# EAGLE design heart (EAGLE 9.4.2)
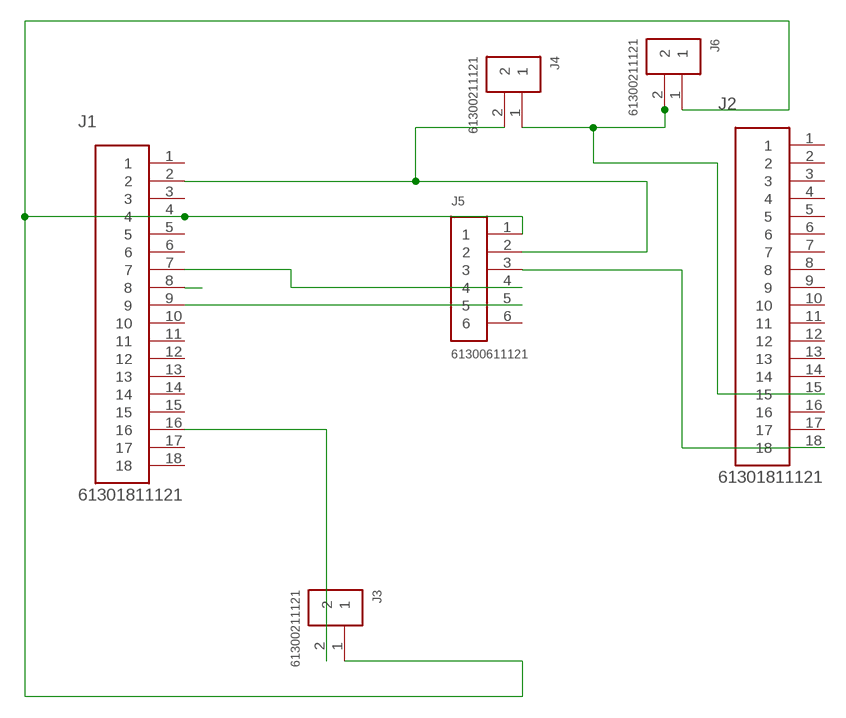
[diagram p0: schematic, sheet 1]

## Parts
J1  61301811121  [61301811121]
J2  61301811121  [61301811121]
J3  61300211121  [61300211121]
J4  61300211121  [61300211121]
J5  61300611121  [61300611121]
J6  61300211121  [61300211121]

## Nets
N$1: J2.18 J5.3
N$2: J1.2 J4.2 J5.2
N$3: J1.8
N$4: J2.15 J4.1 J6.2
N$5: J1.9 J5.5
N$6: J1.7 J5.4
N$7: J1.16 J3.2
N$8: J1.4 J3.1 J5.1 J6.1
Unconnected: J1.1 J1.3 J1.5 J1.6 J1.10 J1.11 J1.12 J1.13 J1.14 J1.15 J1.17 J1.18 J2.1 J2.2 J2.3 J2.4 J2.5 J2.6 J2.7 J2.8 J2.9 J2.10 J2.11 J2.12 J2.13 J2.14 J2.16 J2.17 J5.6

## Library data of the parts
J1 J2 = Headers:61301811121: CONN HEADER VERT 18POS 2.54MM Manufacturer's datasheet <https://katalog.we-online.de/em/datasheet/6130xx11121.pdf>; CREATED_BY: PCBLayout.com; DIGIKEY_PART_NUMBER: 732-5328-ND; MANUFACTURER: Wurth Electronics Inc.; MPN: 61301811121
J3 J4 J6 = Headers:61300211121: CONN HEADER VERT 2POS 2.54MM Manufacturer's datasheet <https://katalog.we-online.de/em/datasheet/6130xx11121.pdf>; CREATED_BY: PCBLayout.com; DIGI_KEY_PART_NUMBER: 732-5315-ND; MANUFACTURER: Wurth Electronics Inc.; MPN: 61300211121
J5 = Headers:61300611121: CONN HEADER VERT 6POS 2.54MM Manufacturer's datasheet <https://katalog.we-online.de/em/datasheet/6130xx11121.pdf>; CREATED_BY: PCBLayout.com; DIGI_KEY_PART_NUMBER: 732-5319-ND; MANUFACTURER: Wurth Electronics Inc.; MPN: 61300611121

## Board
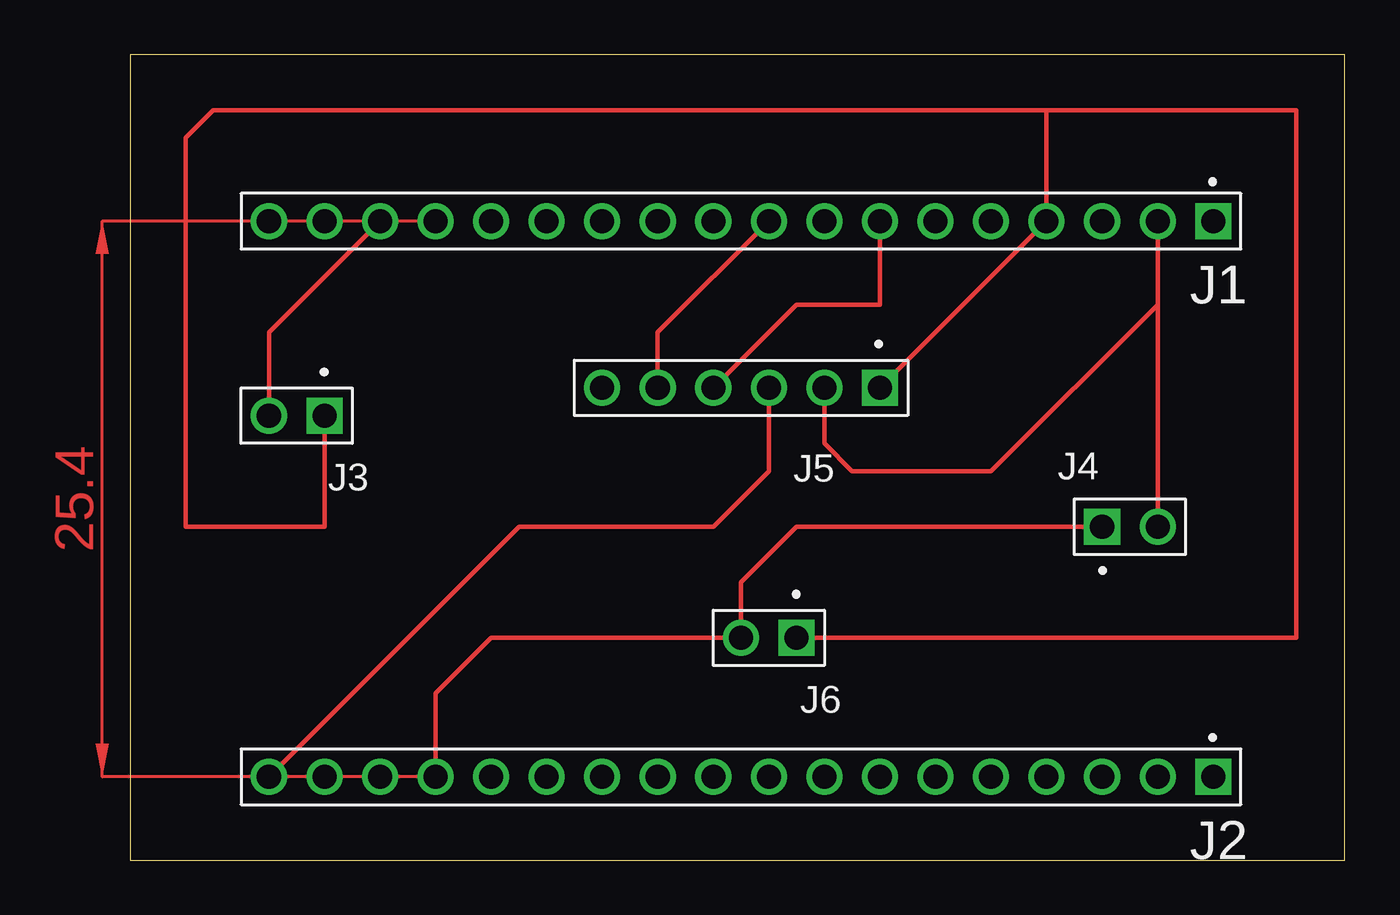
[diagram p1: board, top side]

Size 55.55 x 36.82 mm. Coordinates in mm from the lower left corner, seen from the top.
Outline: 0,0 55.55,0 55.55,36.82 0,36.82 0,0
Copper layers (1*16): Top 0.035mm / dielectric 1.5mm / Bottom 0.035mm
Design rules "OthermillDRC_1_32_v2": minimum track width 8mil, minimum drill 0.8mm, track to track 0.794003125mm, track to pad 0.794003125mm, pad to pad 0.794003125mm, via to via 0.794003125mm, smd to smd 0mil, copper to edge 0mil, drill to drill 1mil, minimum pad ring 10mil, minimum via ring 10mil, stop-mask expansion 1mil, vias tented up to drill 30mil, thermal gap 10mil

### Footprints (pad centres in the part's own frame; a part is rotated, then mirrored left to right if it is on the bottom)
61301811121 = drill 1.1 square: 1 -21.59,0 | drill 1.1: 2 -19.05,0; 3 -16.51,0; 4 -13.97,0; 5 -11.43,0; 6 -8.89,0; 7 -6.35,0; 8 -3.81,0; 9 -1.27,0; 10 1.27,0; 11 3.81,0; 12 6.35,0; 13 8.89,0; 14 11.43,0; 15 13.97,0; 16 16.51,0; 17 19.05,0; 18 21.59,0
61300211121 = drill 1.1 square: 1 -1.27,0 | drill 1.1: 2 1.27,0
61300611121 = drill 1.1 square: 1 -6.35,0 | drill 1.1: 2 -3.81,0; 3 -1.27,0; 4 1.27,0; 5 3.81,0; 6 6.35,0

### Placement (x,y rotation side)
J1  27.94,29.21 180 top
J2  27.94,3.81 180 top
J3  7.62,20.32 180 top
J4  45.72,15.24 0 top
J5  27.94,21.59 180 top
J6  29.21,10.16 180 top

### Tracks (layer width: path | path; a pad name or v marks a point on that pad's centre or on a via)
N$1
  Top 0.203: J2.18 17.78,15.24 26.67,15.24 29.21,17.78 J5.3
N$2
  Top 0.203: 46.99,25.4 39.37,17.78 33.02,17.78 31.75,19.05 J5.2 | 46.99,25.4 J1.2 | 46.99,25.4 J4.2
N$4
  Top 0.203: J2.15 13.97,7.62 16.51,10.16 J6.2 27.94,12.7 30.48,15.24 J4.1
N$5
  Top 0.203: J5.5 24.13,24.13 J1.9
N$6
  Top 0.203: J5.4 30.48,25.4 34.29,25.4 J1.7
N$7
  Top 0.203: J3.2 6.35,24.13 J1.16
N$8
  Top 0.203: J3.1 8.89,15.24 2.54,15.24 2.54,33.02 3.81,34.29 41.91,34.29 | 41.91,34.29 J1.4 J5.1 | J6.1 53.34,10.16 53.34,34.29 41.91,34.29
(copper drawn outside any net)
  shapes: Top area x1